# Altium project IP_PowerDelivery_Adaptor.PrjPcb
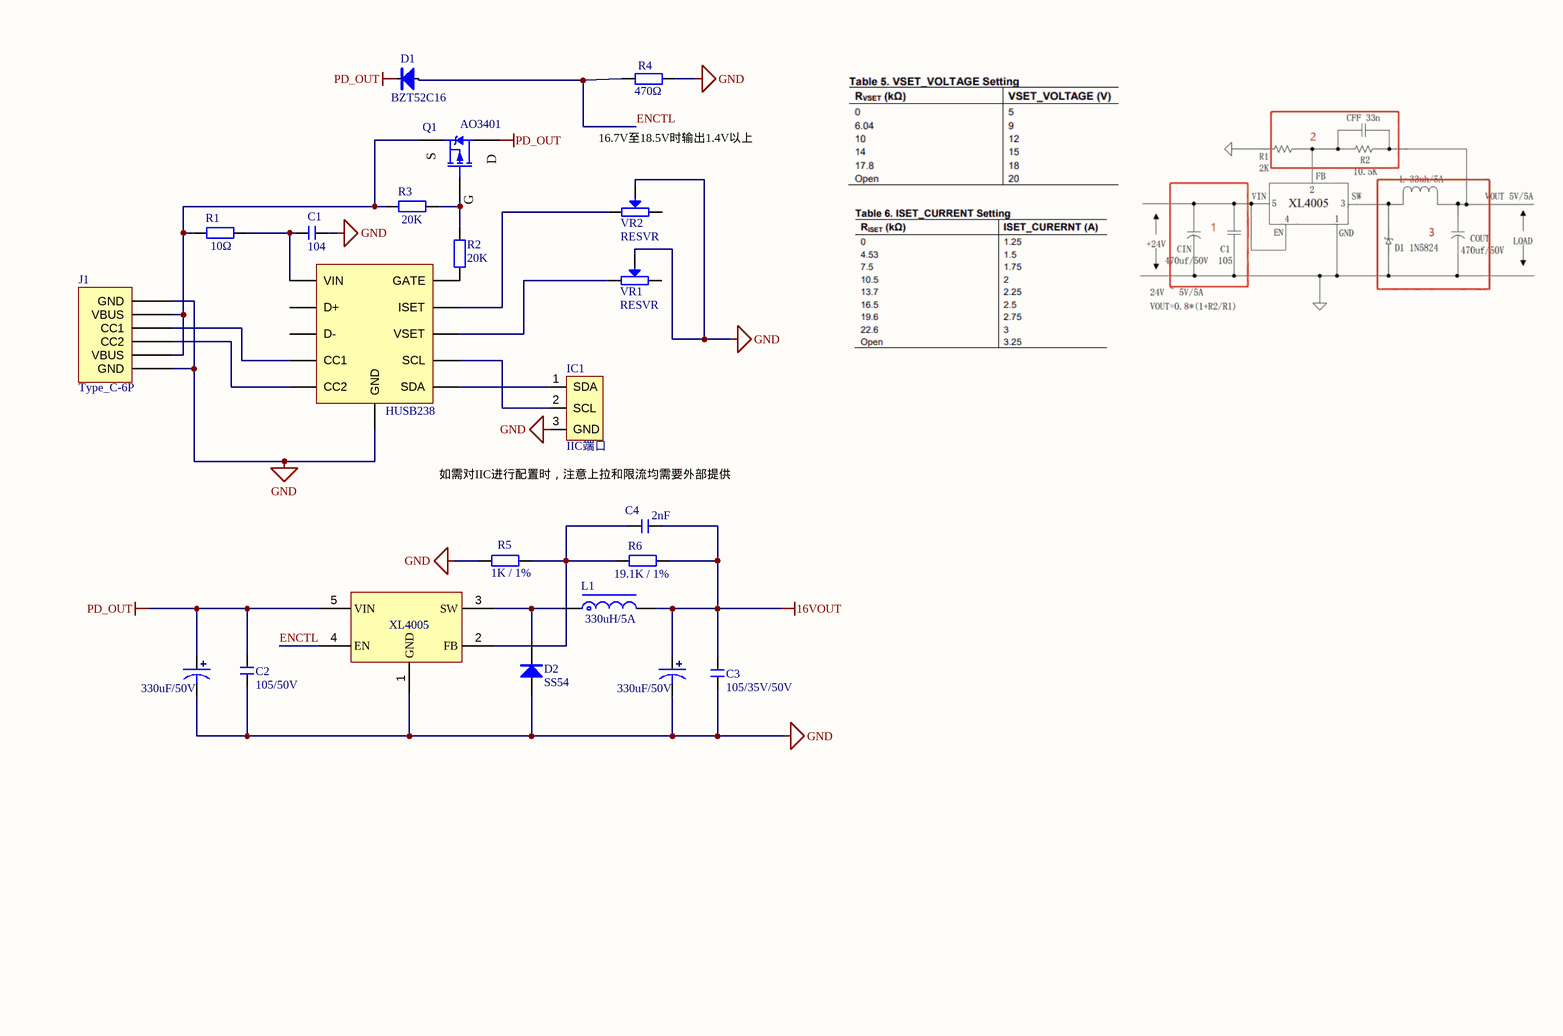
[diagram p0: Sheet.SchDoc]
1 sheet, 22 parts. Net scope: global (net labels, ports and power ports of the same name join across sheets).
Board file: PCB.PcbDoc

## Sheet Sheet.SchDoc
size A4; SheetNumber: 1; SheetTotal: 1

### Parts
C1  104  [0603]
C2  105/50V  [0603]
C3  105/35V/50V  [0603]
C4  2nF  [0603]
D1  BZT52C16  [SOD-123]
D2  SS54  [SMA/DO-214AC]
EC1  330uF/50V  [SMD-EC10X10X10]
EC?  330uF/50V  [SMD-EC10X10X10]
IC1  IIC端口  [IIC_Port - duplicate]  (mechanical)
J1  Type_C-6P  [Type_C-6P]
L1  330uH/5A  [CDRH127]
PD1  HUSB238  [VDFN3X3-10L]
PD2  XL4005  [TO263-5A]
Q1  AO3401  [SOT23]
R1  10Ω  [0603]
R2  20K  [0603]
R3  20K  [0603]
R4  470Ω  [0603]
R5  1K / 1%  [0603]
R6  19.1K / 1%  [0603]
VR1  RESVR  [微调卧式蓝白电位器]
VR2  RESVR  [微调卧式蓝白电位器]

### Nets
16VOUT: C3.1 C4.2 EC?.1 L1.2 R6.1
GND: C1.1 C2.2 C3.2 D2.1(A) EC1.2 EC?.2 IC1.3(GND) J1.A12(GND) J1.B12(GND) PD1.11(GND) PD2.1(GND) R4.2 R5.1 VR1.2 VR2.2
PD_OUT: C2.1 D1.2(K) EC1.1 PD2.5(VIN) Q1.2(D)
ENCTL: D1.1(A) PD2.4(EN) R4.1
NetC1_2: C1.2 PD1.1(VIN) R1.2
NetC4_1: C4.1 PD2.2(FB) R5.2 R6.2
NetD2_2: D2.2(K) L1.1 PD2.3(SW)
NetIC1_1: IC1.1(SDA) PD1.6(SDA)
NetIC1_2: IC1.2(SCL) PD1.7(SCL)
NetJ1_A5: J1.A5(CC1) PD1.4(CC1)
NetJ1_A9: J1.A9(VBUS) J1.B9(VBUS) Q1.3(S) R1.1 R3.1
NetJ1_B5: J1.B5(CC2) PD1.5(CC2)
NetPD1_8: PD1.8(VSET) VR1.1
NetPD1_9: PD1.9(ISET) VR2.1
NetPD1_10: PD1.10(GATE) R2.1
NetQ1_1: Q1.1(G) R2.2 R3.2

Not connected (* = marked no-connect by the designer): PD1 2(D+) 3(D-)

### Notes on the sheet
- 16.7V至18.5V时输出1.4V以上
- 如需对IIC进行配置时，注意上拉和限流均需要外部提供
- THIS DOCUMENT AND THE DATA DISCLOSED HEREIN OR
- HEREWITH IS THE PROPERTY OF ALTIUM LIMITED AND MAY
- DWG NO:
- REVISION
- REV:
- DESCRIPTION
- DATE
- APPROVED
- BE FREELY DISTRIBUTED IN WHOLE. NO RIGHTS ARE
- RESERVED OR EXPRESS OR IMPLIED WARANTEE GIVEN.
- ENG:
- APPROVALS
- PROJECT
- DSN:
- CHK:
- REFERENCE DOCUMENTS
- PROJECT REVISION:
- TITLE
- DOCUMENT REVISION:
- DESIGN ITEM:
- BOM:
- FAB DWG:
- PCB DWG:
- ASSY DWG:
- SCALE:
- A3
- SIZE
- CAGE CODE
- FILE NAME
- DWG NO.
- SHEET
- OF
- REV

### Library data of the parts
C1-C4 = C: 无极性贴片电容; 版权归属: 源创客; BOM名称: 无极性贴片电容; 学习资源: www.ooocke.com
D1 = BZT52C: 稳压二极管; BOM名称: 肖特基二极管; 版权归属: 源创客; 属性: 40V/3A; 学习资源: www.ooocke.com
D2 = SS54: 肖特基二极管; BOM名称: 整流二极管; 版权归属: 源创客; 学习资源: www.ooocke.com
EC1 EC? = SMD_ECAP: 贴片电解电容
IC1 = IIC: IIC端口，用于iic配置
L1 = L-CD: 贴片功率电感; BOM名称: 功率电感; 版权归属: 源创客; 学习资源: www.ooocke.com
PD1 = HUSB238: The HUSB238 is compatible with PD3.0 and Type-C / V1.4, and it can also support Apple Divider 3, BC1.2 / SDP, CDP and DCP while the source is attached.
PD2 = XL4005: XL4005降压型DC-DC转换器(BUCK电路)，开关频率300kHz
Q1 = AO3401: P沟增强型场效应管; BOM名称: P沟场效应管; 版权归属: 源创客; 学习资源: www.ooocke.com
R1-R6 = R: 贴片电阻; 版权归属: 源创客; BOM名称: 贴片电阻; 学习资源: www.ooocke.com